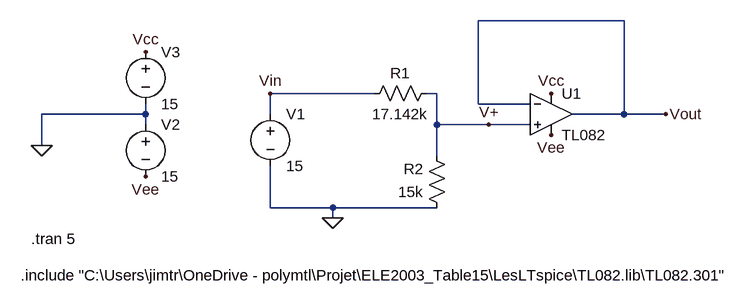
[diagram p0: schematic isolation_impédance.asc]
isolation_impédance.asc, the LTspice schematic file:
Version 4.1
SHEET 1 1408 680
WIRE 560 0 336 0
WIRE 176 112 16 112
WIRE 272 112 256 112
WIRE 336 128 336 0
WIRE 416 128 336 128
WIRE -176 144 -176 128
WIRE -176 144 -336 144
WIRE 16 144 16 112
WIRE 560 144 560 0
WIRE 560 144 480 144
WIRE 624 144 560 144
WIRE -176 160 -176 144
WIRE 272 160 272 112
WIRE 352 160 272 160
WIRE 416 160 352 160
WIRE -336 192 -336 144
WIRE 272 208 272 160
WIRE 16 288 16 224
WIRE 112 288 16 288
WIRE 272 288 112 288
WIRE 112 304 112 288
FLAG -176 240 Vee
FLAG -176 48 Vcc
FLAG -336 192 0
FLAG 448 176 Vee
FLAG 448 112 Vcc
FLAG 16 112 Vin
FLAG 624 144 Vout
FLAG 352 160 V+
FLAG 112 304 0
SYMBOL voltage 16 128 R0
WINDOW 123 0 0 Left 0
WINDOW 39 0 0 Left 0
SYMATTR InstName V1
SYMATTR Value 15
SYMBOL res 272 96 R90
WINDOW 0 0 56 VBottom 2
WINDOW 3 32 56 VTop 2
SYMATTR InstName R1
SYMATTR Value 17.142k
SYMBOL res 288 304 R180
WINDOW 0 36 76 Left 2
WINDOW 3 36 40 Left 2
SYMATTR InstName R2
SYMATTR Value 15k
SYMBOL OpAmps\\opamp2 448 80 R0
SYMATTR InstName U1
SYMATTR Value TL082
SYMBOL voltage -176 144 R0
SYMATTR InstName V2
SYMATTR Value 15
SYMBOL voltage -176 32 R0
SYMATTR InstName V3
SYMATTR Value 15
TEXT -368 392 Left 2 !.include "C:\\Users\\jimtr\\OneDrive - polymtl\\Projet\\ELE2003_Table15\\LesLTspice\\TL082.lib\\TL082.301"
TEXT -352 336 Left 2 !.tran 5

The netlist it stands for:
* isolation_impédance.asc
V1 Vin 0 15
R1 V+ Vin 17.142k
R2 0 V+ 15k
X§U1 V+ Vout Vcc Vee Vout TL082  ; pins In+ In- V+ V- OUT
V2 0 Vee 15
V3 Vcc 0 15
.include "C:\Users\jimtr\OneDrive - polymtl\Projet\ELE2003_Table15\LesLTspice\TL082.lib\TL082.301"
.tran 5
.backanno
.end